# Altium project LM_HTR_001_Rev_C.PrjPcb
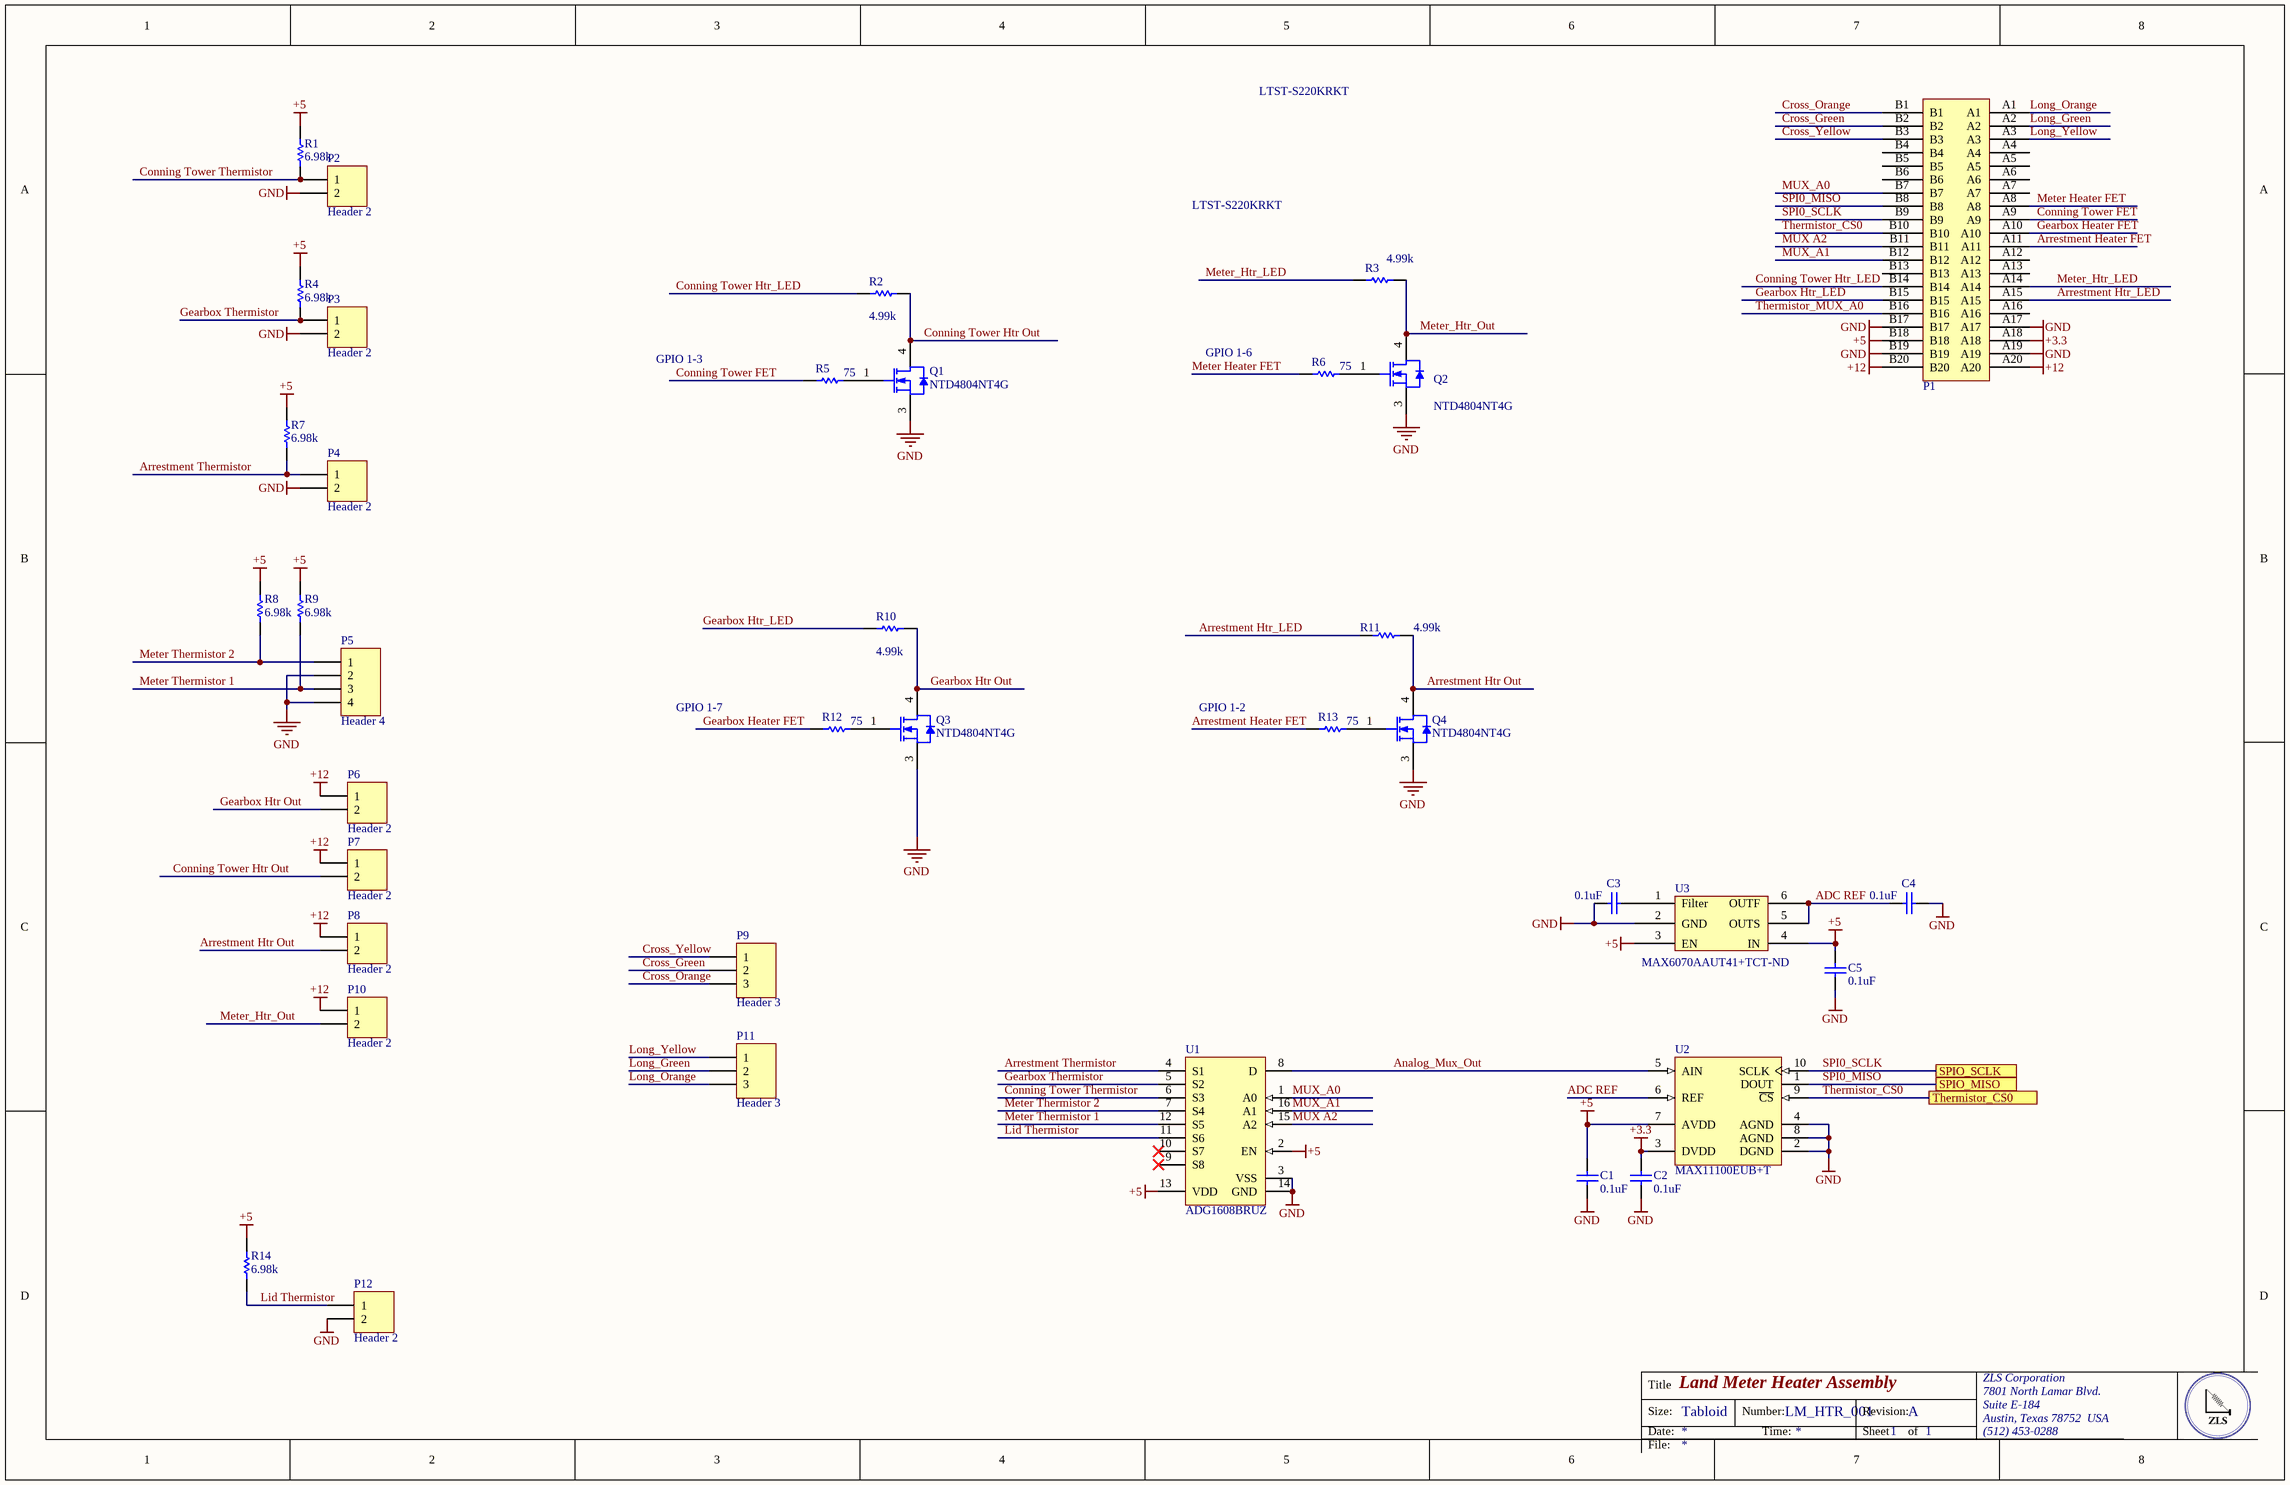
[diagram p0: LM_HTR_001.SchDoc]
2 sheets, 86 parts. Net scope: flat (ports and power ports of the same name join across sheets).
Board file: LM_HTR_001.PcbDoc
Sheets:
  LM_HTR_001.SchDoc
  Signal_Conditioner.SchDoc

## Sheet LM_HTR_001.SchDoc: Land Meter Heater Assembly
size Tabloid; DocumentNumber: LM_HTR_001; Revision: A; SheetNumber: 1; SheetTotal: 1

### Parts
C1  0.1uF  [CAPC0402(1005)60_L]
C2  0.1uF  [CAPC0402(1005)60_L]
C3  0.1uF  [CAPC0402(1005)60_L]
C4  0.1uF  [CAPC0402(1005)60_L]
C5  0.1uF  [CAPC0402(1005)60_L]
P1  MEC6-120-02-PCB_  [MEC6-120-02-PCB]  (value not drawn)
P2  Header 2  [HDR1X2]
P3  Header 2  [HDR1X2]
P4  Header 2  [HDR1X2]
P5  Header 4  [HDR1X4]
P6  Header 2  [HDR1X2]
P7  Header 2  [HDR1X2]
P8  Header 2  [HDR1X2]
P9  Header 3  [HDR1X3]
P10  Header 2  [HDR1X2]
P11  Header 3  [HDR1X3]
P12  Header 2  [HDR1X2]
Q1  NTD4804NT4G  [ONSC-DPAK-3-369AA-01_V]
Q2  NTD4804NT4G  [ONSC-DPAK-3-369AA-01_V]
Q3  NTD4804NT4G  [ONSC-DPAK-3-369AA-01_V]
Q4  NTD4804NT4G  [ONSC-DPAK-3-369AA-01_V]
R1  Resistance (Ohms): 6.98k  [RESC0805(2012)_N]  (hidden comment: 6K98 1% 0805(2012))
R2  Resistance (Ohms): 4.99k  [RESC0805(2012)_L]
R3  Resistance (Ohms): 4.99k  [RESC0805(2012)_L]
R4  Resistance (Ohms): 6.98k  [RESC0805(2012)_N]  (hidden comment: 6K98 1% 0805(2012))
R5  Resistance (Ohms): 75  [RESC0805(2012)_L]
R6  Resistance (Ohms): 75  [RESC0805(2012)_L]
R7  Resistance (Ohms): 6.98k  [RESC0805(2012)_N]  (hidden comment: 6K98 1% 0805(2012))
R8  Resistance (Ohms): 6.98k  [RESC0805(2012)_N]  (hidden comment: 6K98 1% 0805(2012))
R9  Resistance (Ohms): 6.98k  [RESC0805(2012)_N]  (hidden comment: 6K98 1% 0805(2012))
R10  Resistance (Ohms): 4.99k  [RESC0805(2012)_L]
R11  Resistance (Ohms): 4.99k  [RESC0805(2012)_L]
R12  Resistance (Ohms): 75  [RESC0805(2012)_L]
R13  Resistance (Ohms): 75  [RESC0805(2012)_L]
R14  Resistance (Ohms): 6.98k  [RESC0805(2012)_N]  (hidden comment: 6K98 1% 0805(2012))
U1  ADG1608BRUZ  [ADI-RU-16_M]
U2  MAX11100EUB+T  [U10+2_L]
U3  Supplier Part Number 1: MAX6070AAUT41+TCT-ND  [SOT95P280X445-6N]  (hidden comment: MAX6070AAUT41+T)

### Ports
SPIO_MISO, SPIO_SCLK, Thermistor_CS0

### Nets
+3.3: C2.1 P1.A18 U2.3(DVDD)
+5: C1.1 C5.1 P1.B18 R1.2 R4.2 R7.1 R8.1 R9.2 R14.1 U1.2(EN) U1.13(VDD) U2.7(AVDD) U3.3(EN) U3.4(IN)
+12: P1.A20 P1.B20 P6.1 P7.1 P8.1 P10.1
GND: C1.2 C2.2 C3.2 C4.1 C5.2 P1.A17 P1.A19 P1.B17 P1.B19 P2.2 P3.2 P4.2 P5.2 P5.4 P12.2 Q1.3(S) Q2.3(S) Q3.3(S) Q4.3(S) U1.3(VSS) U1.14(GND) U2.2(DGND) U2.4(AGND) U2.8(AGND) U3.2(GND)
ADC REF: C4.2 U2.6(REF) U3.5(OUTS) U3.6(OUTF)
Analog_Mux_Out: U1.8(D) U2.5(AIN)
Arrestment Heater FET: P1.A11 R13.1
Arrestment Htr Out: P8.2 Q4.4(D) R11.2
Arrestment Htr_LED: P1.A15 R11.1
Arrestment Thermistor: P4.1 R7.2 U1.4(S1)
Conning Tower FET: P1.A9 R5.1
Conning Tower Htr Out: P7.2 Q1.4(D) R2.1
Conning Tower Htr_LED: P1.B14 R2.2
Conning Tower Thermistor: P2.1 R1.1 U1.6(S3)
Cross_Green: P1.B2 P9.2
Cross_Orange: P1.B1 P9.3
Cross_Yellow: P1.B3 P9.1
Gearbox Heater FET: P1.A10 R12.1
Gearbox Htr Out: P6.2 Q3.4(D) R10.1
Gearbox Htr_LED: P1.B15 R10.2
Gearbox Thermistor: P3.1 R4.1 U1.5(S2)
Lid Thermistor: P12.1 R14.2 U1.11(S6)
Long_Green: P1.A2 P11.2
Long_Orange: P1.A1 P11.3
Long_Yellow: P1.A3 P11.1
Meter Heater FET: P1.A8 R6.1
Meter Thermistor 1: P5.3 R9.1 U1.12(S5)
Meter Thermistor 2: P5.1 R8.2 U1.7(S4)
Meter_Htr_LED: P1.A14 R3.1
Meter_Htr_Out: P10.2 Q2.4(D) R3.2
MUX A2: P1.B11 U1.15(A2)
MUX_A0: P1.B7 U1.1(A0)
MUX_A1: P1.B12 U1.16(A1)
SPI0_MISO: P1.B8 U2.1(DOUT) ; port SPIO_MISO
SPI0_SCLK: P1.B9 U2.10(SCLK) ; port SPIO_SCLK
Thermistor_CS0: P1.B10 U2.9(~{CS}) ; port Thermistor_CS0
Thermistor_MUX_A0: P1.B16
NetC3_1: C3.1 U3.1(Filter)
NetQ1_1: Q1.1(G) R5.2
NetQ2_1: Q2.1(G) R6.2
NetQ3_1: Q3.1(G) R12.2
NetQ4_1: Q4.1(G) R13.2

Not connected (* = marked no-connect by the designer): P1 A4 A5 A6 A7 A12 A13 A16 B4 B5 B6 B13; U1 9(S8)* 10(S7)*

### Notes on the sheet
- LTST-S220KRKT
- GPIO 1-3
- GPIO 1-6
- GPIO 1-7
- GPIO 1-2
- Title
- Size:
- Date:
- Tabloid
- Number:
- Time:
- Revision:
- Sheet
- of
- ZLS Corporation
- 7801 North Lamar Blvd.
- Suite E-184
- Austin, Texas 78752  USA
- (512) 453-0288
- File:

### Library data of the parts
C1-C5 = CMP-1034-00252-1: CAP CER 0.1UF 10V X7R 0402; Manufacturer: Murata Electronics North America; Manufacturer Part Number: GRM155R71A104KA01D; Tolerance: ±10%; Supplier 1: Digi-Key; Supplier Part Number 1: 490-6321-1-ND; RoHS: RoHS Compliant; Category: Capacitors; Stock 1: 2920395; Pricing 1: 1=0.1, 10=0.014, 100=0.0063, 500=0.00446, 1000=0.00351, 2500=0.00319, 5000=0.00293 (USD); Packaging: Cut Tape (CT); Part Status: Active; Voltage - Rated: 10V; Temperature Coefficient: X7R; Operating Temperature: -55°C ~ 125°C; Features: -; Ratings: -; Applications: General Purpose; Mounting Type: Surface Mount, MLCC; Package / Case: 0402 (1005 Metric); Size / Dimension: 0.039" L x 0.020" W (1.00mm x 0.50mm); Height - Seated (Max): -; Thickness (Max): 0.022" (0.55mm); Lead Spacing: -; ComponentLink1URL: http://www.murata.com/~/media/webrenewal/support/library/catalog/products/capacitor/mlcc/c02e.ashx?la=en-us; ComponentLink1Description: http://www.murata.com/~/media/webrenewal/support/library/catalog/products/capacitor/mlcc/c02e.ashx?la=en-us
P2-P4 P6-P8 P10 P12 = Header 2: Header, 2-Pin; LatestRevisionDate: 17-Jul-2002; LatestRevisionNote: Re-released for DXP Platform.; Publisher: Altium Limited
P5 = Header 4: Header, 4-Pin; LatestRevisionDate: 17-Jul-2002; LatestRevisionNote: Re-released for DXP Platform.; Publisher: Altium Limited
P9 P11 = Header 3: Header, 3-Pin; LatestRevisionDate: 17-Jul-2002; LatestRevisionNote: Re-released for DXP Platform.; Publisher: Altium Limited
Q1-Q4 = CMP-1058-00341-1: Power MOSFET, 30 V, 117 A, Single N-Channel, 3-Pin DPAK, Pb-Free, Tape and Reel; Manufacturer: On Semiconductor; Coss Typ (pF): 952; Qrr Typ (nC): 30; VGS Max (V): 20; ID Max (A): 117; Crss Typ (pF): 556; Channel Polarity: N Channel; Ciss Typ (pF): 4490; VGS(th) Max (V): 2.5; ComponentLink2Description: Datasheet; ComponentLink3Description: Package Specification; Mounting Technology: Surface Mount; PackageDescription: 3-Pin Flange Mount, Body 6.54 x 6.095 mm, Pitch 2.29 mm; PackageVersion: Rev. B, 06/2010; PartNumber: NTD4804NT4G; ComponentLink2URL: http://www.onsemi.cn/pub_link/Collateral/NTD4804N-D.PDF; RoHS: Pb-Free; Configuration: Single; DatasheetVersion: Rev. 8; PackageReference: DPAK-3-369AA-01; ComponentLink3URL: http://www.onsemi.cn/pub_link/Collateral/369AA.PDF; ComponentLink1Description: Manufacturer URL; Packing: Tape and Reel; Package Type: DPAK-3; ComponentLink1URL: http://www.onsemi.com/; V(BR)DSS Min (V): 30; Supplier 1: Digi-Key; Supplier Part Number 1: NTD4804NT4GOSDKR-ND
R1 R4 R7-R9 R14 = CMP-1013-00606-1: 6K98 0.125W 1% 0805 (2012 Metric)  SMD; Manufacturer: Vishay Dale; Manufacturer Part Number: CRCW08056K98FKEA; Power (Watts): 0.125W, 1/8W; Temperature Coefficient: ±100ppm/°C; Supplier 1: Digi-Key; Supplier Part Number 1: 541-6.98KCCT-ND; RoHS: RoHS Compliant; Category: Resistors; Stock 1: 34245; Pricing 1: 1=0.1, 10=0.044, 100=0.0178, 1000=0.00802, 2500=0.00696 (USD); Packaging: Cut Tape (CT); Part Status: Active; Tolerance: ±1%; Composition: Thick Film; Features: Automotive AEC-Q200; Operating Temperature: -55°C ~ 155°C; Package / Case: 0805 (2012 Metric); Supplier Device Package: 0805; Size / Dimension: 0.079" L x 0.049" W (2.00mm x 1.25mm); Height - Seated (Max): 0.020" (0.50mm); Failure Rate: -; ComponentLink1URL: http://www.vishay.com/docs/20035/dcrcwe3.pdf; ComponentLink1Description: http://www.vishay.com/docs/20035/dcrcwe3.pdf
R2 R3 R10 R11 = CMP-1013-00393-1: Manufacturer: Vishay Dale; Manufacturer Part Number: CRCW08054K99FKEA; Tolerance: ±1%; Power (Watts): 0.125W, 1/8W; Temperature Coefficient: ±100ppm/°C; Supplier 1: Digi-Key; Supplier Part Number 1: 541-4.99KCCT-ND; RoHS: RoHS Compliant; Category: Resistors; Stock 1: 93740; Pricing 1: 1=0.1, 10=0.044, 100=0.0178, 1000=0.00802, 2500=0.00696 (USD); Packaging: Cut Tape (CT); Part Status: Active; Composition: Thick Film; Features: Automotive AEC-Q200; Operating Temperature: -55°C ~ 155°C; Package / Case: 0805 (2012 Metric); Supplier Device Package: 0805; Size / Dimension: 0.079" L x 0.049" W (2.00mm x 1.25mm); Height - Seated (Max): 0.020" (0.50mm); Failure Rate: -; ComponentLink1URL: http://www.vishay.com/docs/20035/dcrcwe3.pdf; ComponentLink1Description: http://www.vishay.com/docs/20035/dcrcwe3.pdf
R5 R6 R12 R13 = CMP-1013-00393-1: Manufacturer: Vishay Dale; Manufacturer Part Number: CRCW080575R0FKEA; Tolerance: ±1%; Power (Watts): 0.125W, 1/8W; Temperature Coefficient: ±100ppm/°C; Supplier 1: Digi-Key; Supplier Part Number 1: 541-75.0CCT-ND; RoHS: RoHS Compliant; Category: Resistors; Stock 1: 32546; Pricing 1: 1=0.1, 10=0.044, 100=0.0178, 1000=0.00802, 2500=0.00696 (USD); Packaging: Cut Tape (CT); Part Status: Active; Composition: Thick Film; Features: Automotive AEC-Q200; Operating Temperature: -55°C ~ 155°C; Package / Case: 0805 (2012 Metric); Supplier Device Package: 0805; Size / Dimension: 0.079" L x 0.049" W (2.00mm x 1.25mm); Height - Seated (Max): 0.020" (0.50mm); Failure Rate: -; ComponentLink1URL: http://www.vishay.com/docs/20035/dcrcwe3.pdf; ComponentLink1Description: http://www.vishay.com/docs/20035/dcrcwe3.pdf
U1 = CMP-0793-00136-1: 4.5 Ohm Ron, 8-Channel +/-5 V,+12 V, +5 V and +3.3 V Multiplexer, 16-pin SOP (RU-16), Tube; Manufacturer: Analog Devices; Max Analog Signal Range: 0 to Vdd; Ron (ohms): 4.4; t transition (s): 150n; Bandwidth (Hz): 40M, 40M, 37M, 34M; Code_JEDEC: MO-153AB; PackageReference: RU-16; PackageDescription: 16-Pin Thin Shrink Small Outline Package, Body 5 x 4.4 mm, Pitch 0.65 mm; ComponentLink1Description: Manufacturer URL; ComponentLink2Description: Datasheet; PartNumber: ADG1608BRUZ; Mounting Technology: Surface Mount; PackageVersion: Nov-02; ComponentLink3Description: Package Specification; DatasheetVersion: Rev. 0; Packing: Tube; ComponentLink1URL: http://www.analog.com/en/index.html; ComponentLink3URL: http:/www.analog.com/static/imported-files/packages/36244347913743854010197452789RU16.pdf; ComponentLink2URL: http://www.analog.com/static/imported-files/data_sheets/ADG1608_1609.pdf
U2 = CMP-0249-00017-1: 16-Bit, +5V, 200ksps ADC with 10uA Shutdown, 10-Pin uMAX, -40°C to +85°C, Pb-Free, Tape and Reel; DatasheetVersion: Rev 1, Jan-2012; ComponentLink3URL: http://pdfserv.maxim-ic.com/package_dwgs/21-0061.PDF; PackageReference: U10+2; ComponentLink2URL: http://datasheets.maxim-ic.com/en/ds/MAX11100.pdf; PackageVersion: revL, 2008; ComponentLink1Description: Manufacturer URL; Code_JEDEC: MO-187-BA; ComponentLink1URL: http://www.maxim-ic.com; ComponentLink3Description: Package Specification; PackageDescription: 10-Pin Micro-MAX Thin Shrink Small Outline (uSOP), 3 x 3 x 0.85 mm Body, 0.5 mm Pitch, Pb-Free; ComponentLink2Description: Datasheet
U3 = MAX6070AAUT41+T: IC VREF SERIES 4.096V SOT23; Manufacturer: Maxim Integrated; Output Type: Fixed; Tolerance: ±0.04%; Temperature Coefficient: 6ppm/°C; Noise - 0.1Hz to 10Hz: 9.6µVp-p; Noise - 10Hz to 10kHz: 9µVrms; Voltage - Input: 4.3 V ~ 5.5 V; Current - Supply: 350µA; Supplier 1: Digi-Key; Manufacturer Part Number: MAX6070AAUT41+T; RoHS: RoHS Compliant; Category: Integrated Circuits (ICs); Stock 1: 2623; Pricing 1: 1=3.41, 10=3.213, 25=2.5704, 50=2.4418, 100=2.2491, 250=2.13344, 500=2.05634 (USD); Packaging: Cut Tape (CT); Part Status: Active; Reference Type: Series; Voltage - Output (Min/Fixed): 4.096V; Operating Temperature: -40°C ~ 125°C (TA); Mounting Type: Surface Mount; Package / Case: SOT-23-6; Supplier Device Package: SOT-23-6; ComponentLink1URL: https://datasheets.maximintegrated.com/en/ds/MAX6070-MAX6071.pdf; ComponentLink1Description: https://datasheets.maximintegrated.com/en/ds/MAX6070-MAX6071.pdf

## Sheet Signal_Conditioner.SchDoc: Signal Conditioner
size Tabloid; DocumentNumber: LM-001; Revision: C; SheetNumber: 2; SheetTotal: 2; DocumentName: Signal Conditioner
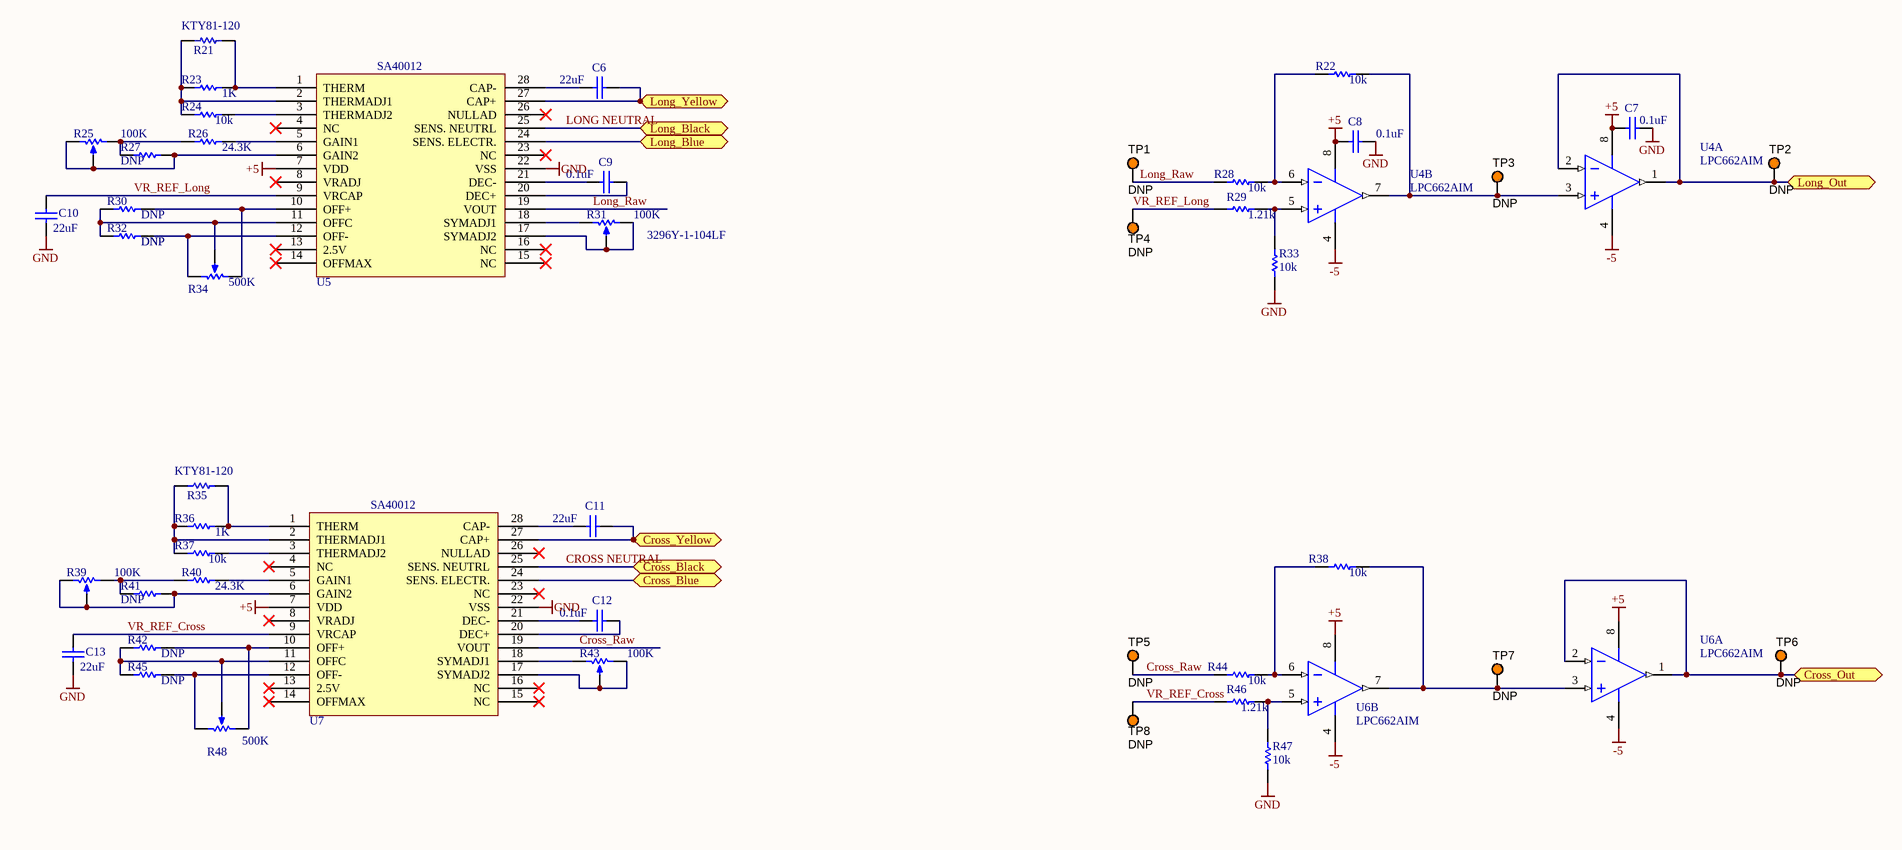
[diagram p1: Signal_Conditioner.SchDoc]

### Parts
C6  22uF  [CAPC0805(2012)145_N]
C7  0.1uF  [CAPC0402(1005)60_L]
C8  0.1uF  [CAPC0402(1005)60_L]
C9  0.1uF  [CAPC0402(1005)60_L]
C10  22uF  [CAPC0805(2012)145_N]
C11  22uF  [CAPC0805(2012)145_N]
C12  0.1uF  [CAPC0402(1005)60_L]
C13  22uF  [CAPC0805(2012)145_N]
R21  KTY81-120  [KTY81-120]
R22  10k  [RESC0805(2012)_L]
R23  1K  [RESC0805(2012)_L]
R24  10k  [RESC0805(2012)_L]
R25  100K  [Trimmer 2.54]
R26  24.3K  [RESC0805(2012)_L]
R27  DNP  [RESC0805(2012)_L]
R28  10k  [RESC0805(2012)_L]
R29  1.21k  [RESC0805(2012)_L]
R30  DNP  [RESC0805(2012)_L]
R31  100K  [Trimmer 2.54]
R32  DNP  [RESC0805(2012)_L]
R33  10k  [RESC0805(2012)_L]
R34  500K  [Trimmer 2.54]
R35  KTY81-120  [KTY81-120]
R36  1K  [RESC0805(2012)_L]
R37  10k  [RESC0805(2012)_L]
R38  10k  [RESC0805(2012)_L]
R39  100K  [Trimmer 2.54]
R40  24.3K  [RESC0805(2012)_L]
R41  DNP  [RESC0805(2012)_L]
R42  DNP  [RESC0805(2012)_L]
R43  100K  [Trimmer 2.54]
R44  10k  [RESC0805(2012)_L]
R45  DNP  [RESC0805(2012)_L]
R46  1.21k  [RESC0805(2012)_L]
R47  10k  [RESC0805(2012)_L]
R48  500K  [Trimmer 2.54]
TP1  DNP  [KSTN-5003]
TP2  DNP  [KSTN-5003]
TP3  DNP  [KSTN-5003]
TP4  DNP  [KSTN-5003]
TP5  DNP  [KSTN-5003]
TP6  DNP  [KSTN-5003]
TP7  DNP  [KSTN-5003]
TP8  DNP  [KSTN-5003]
U4  LPC662AIM  [D0008A_M]  (parts A,B of 2)
U5  SA40012  [SA40012]
U6  LPC662AIM  [D0008A_M]  (parts A,B of 2)
U7  SA40012  [SA40012]

### Ports
Cross_Black, Cross_Blue, Cross_Out, Cross_Yellow, Long_Black, Long_Blue, Long_Out, Long_Yellow

### Nets
+5: C7.1 C8.1 U4.8(V+) U5.7(VDD) U6.8(V+) U7.7(VDD)
-5: U4.4(V-) U6.4(V-)
GND: C7.2 C8.2 C10.2 C13.2 R33.1 R47.1 U5.22(VSS) U7.22(VSS)
CROSS NEUTRAL: U7.25(SENS._NEUTRL) ; port Cross_Black
Cross_Raw: R44.1 TP5.1 U7.19(VOUT)
LONG NEUTRAL: U5.25(SENS._NEUTRL) ; port Long_Black
Long_Raw: R28.1 TP1.1 U5.19(VOUT)
VR_REF_Cross: C13.1 R46.2 TP8.1 U7.9(VRCAP)
VR_REF_Long: C10.1 R29.2 TP4.1 U5.9(VRCAP)
NetC6_1: C6.1 U5.28(CAP-)
NetC6_2: C6.2 U5.27(CAP+) ; port Long_Yellow
NetC9_1: C9.1 U5.20(DEC+)
NetC9_2: C9.2 U5.21(DEC-)
NetC11_1: C11.1 U7.28(CAP-)
NetC11_2: C11.2 U7.27(CAP+) ; port Cross_Yellow
NetC12_1: C12.1 U7.20(DEC+)
NetC12_2: C12.2 U7.21(DEC-)
NetR21_1: R21.1 R23.1 R24.1 U5.2(THERMADJ1)
NetR21_2: R21.2 R23.2 U5.1(THERM)
NetR22_1: R22.1 R28.2 U4.6(INB-)
NetR22_2: R22.2 TP3.1 U4.3(INA+) U4.7(OUTB)
NetR24_2: R24.2 U5.3(THERMADJ2)
NetR25_1: R25.1(a) R25.2(b) R27.2 U5.6(GAIN2)
NetR25_3: R25.3(c) R26.1 R27.1
NetR26_2: R26.2 U5.5(GAIN1)
NetR29_1: R29.1 R33.2 U4.5(INB+)
NetR30_1: R30.1 R32.1 R34.2(b) U5.11(OFFC)
NetR30_2: R30.2 R34.1(a) U5.10(OFF+)
NetR31_1: R31.1(a) U5.18(SYMADJ1)
NetR31_2: R31.2(b) R31.3(c) U5.17(SYMADJ2)
NetR32_2: R32.2 R34.3(c) U5.12(OFF-)
NetR35_1: R35.1 R36.1 R37.1 U7.2(THERMADJ1)
NetR35_2: R35.2 R36.2 U7.1(THERM)
NetR37_2: R37.2 U7.3(THERMADJ2)
NetR38_1: R38.1 R44.2 U6.6(INB-)
NetR38_2: R38.2 TP7.1 U6.3(INA+) U6.7(OUTB)
NetR39_1: R39.1(a) R39.2(b) R41.2 U7.6(GAIN2)
NetR39_3: R39.3(c) R40.1 R41.1
NetR40_2: R40.2 U7.5(GAIN1)
NetR42_1: R42.1 R45.1 R48.2(b) U7.11(OFFC)
NetR42_2: R42.2 R48.1(a) U7.10(OFF+)
NetR43_1: R43.1(a) U7.18(SYMADJ1)
NetR43_2: R43.2(b) R43.3(c) U7.17(SYMADJ2)
NetR45_2: R45.2 R48.3(c) U7.12(OFF-)
NetR46_1: R46.1 R47.2 U6.5(INB+)
NetTP2_1: TP2.1 U4.1(OUTA) U4.2(INA-) ; port Long_Out
NetTP6_1: TP6.1 U6.1(OUTA) U6.2(INA-) ; port Cross_Out
NetU5_24: U5.24(SENS._ELECTR.) ; port Long_Blue
NetU7_24: U7.24(SENS._ELECTR.) ; port Cross_Blue

Not connected (* = marked no-connect by the designer): U5 4(NC)* 8(VRADJ)* 13(2.5V)* 14(OFFMAX)* 15(NC)* 16(NC)* 23(NC)* 26(NULLAD)*; U7 4(NC)* 8(VRADJ)* 13(2.5V)* 14(OFFMAX)* 15(NC)* 16(NC)* 23(NC)* 26(NULLAD)*

### Notes on the sheet
- (near R32) DNP
- (near R31) 3296Y-1-104LF
- Title
- Size:
- Date:
- Tabloid
- Number:
- Time:
- Revision:
- Sheet
- of
- ZLS Corporation
- 7801 North Lamar Blvd.
- Suite E-184
- Austin, Texas 78752  USA
- (512) 453-0288
- File:

### Library data of the parts
C6 C10 C11 C13 = CMP-1036-04795-1: CAP CER 22UF 16V X5R 0805; Manufacturer: Murata Electronics North America; Manufacturer Part Number: GRM219R61C226ME15L; Tolerance: ±20%; Notification: Current market demand for these product types have resulted in fluctuating and extending lead times. Lead times may differ.; Supplier 1: Digi-Key; Supplier Part Number 1: 490-9952-1-ND; RoHS: RoHS Compliant; Category: Capacitors; Stock 1: 200; Pricing 1: 1=0.51, 10=0.359, 100=0.2364, 500=0.1751, 1000=0.14884 (USD); Packaging: Cut Tape (CT); Part Status: Active; Voltage - Rated: 16V; Temperature Coefficient: X5R; Operating Temperature: -55°C ~ 85°C; Features: -; Ratings: -; Applications: General Purpose; Mounting Type: Surface Mount, MLCC; Package / Case: 0805 (2012 Metric); Size / Dimension: 0.079" L x 0.049" W (2.00mm x 1.25mm); Height - Seated (Max): -; Thickness (Max): 0.039" (1.00mm); Lead Spacing: -; Lead Style: -; ComponentLink1URL: http://search.murata.co.jp/Ceramy/image/img/A01X/G101/ENG/GRM219R61C226ME15-01.pdf; ComponentLink1Description: http://search.murata.co.jp/Ceramy/image/img/A01X/G101/ENG/GRM219R61C226ME15-01.pdf
C7 C8 = CMP-1034-00252-1: as C1 on sheet LM_HTR_001; Supplier 1: Digi-Key; Supplier Part Number 1: 490-6321-1-ND; RoHS: RoHS Compliant; Category: Capacitors; Stock 1: 2920395; Pricing 1: 1=0.1, 10=0.014, 100=0.0063, 500=0.00446, 1000=0.00351, 2500=0.00319, 5000=0.00293 (USD); Packaging: Cut Tape (CT); Part Status: Active; Voltage - Rated: 10V; Temperature Coefficient: X7R; Operating Temperature: -55°C ~ 125°C; Features: -; Ratings: -; Applications: General Purpose; Mounting Type: Surface Mount, MLCC; Package / Case: 0402 (1005 Metric); Size / Dimension: 0.039" L x 0.020" W (1.00mm x 0.50mm); Height - Seated (Max): -; Thickness (Max): 0.022" (0.55mm); Lead Spacing: -; ComponentLink1URL: http://www.murata.com/~/media/webrenewal/support/library/catalog/products/capacitor/mlcc/c02e.ashx?la=en-us; ComponentLink1Description: http://www.murata.com/~/media/webrenewal/support/library/catalog/products/capacitor/mlcc/c02e.ashx?la=en-us
C9 C12 = CMP-1034-00252-1: CAP CER 0.1UF 10V X7R 0402
R21 R35 = KTY81-120: THERMISTOR PTC 1K OHM PBCYT2; Manufacturer: NXP USA Inc.; Manufacturer Part Number: KTY81/120,112; Supplier 1: Digi-Key; Supplier Part Number 1: 568-12506-ND; RoHS: RoHS Compliant; Category: Sensors, Transducers; Stock 1: 2002; Pricing 1: 1=1.11, 5=1.068, 10=0.868, 25=0.748, 50=0.648, 100=0.5878, 500=0.49432, 1000=0.44088, 5000=0.4008 (USD); Packaging: Bulk; Part Status: Active; Resistance Tolerance: -; Operating Temperature: -55°C ~ 150°C; Mounting Type: Through Hole; Package / Case: TO-226-2, TO-92-2 (TO-226AC); Supplier Device Package: PBCYT2; ComponentLink1URL: http://www.nxp.com/documents/data_sheet/KTY81_SER.pdf; ComponentLink1Description: http://www.nxp.com/documents/data_sheet/KTY81_SER.pdf
R22 R24 R27 R28 R33 R37 R38 R41 R44 R47 = CMP-1013-00393-1: RES SMD 10K OHM 1% 1/8W 0805; Manufacturer: Vishay Dale; Manufacturer Part Number: CRCW080510K0FKEA; Power (Watts): 0.125W, 1/8W; Temperature Coefficient: ±100ppm/°C; Supplier 1: Digi-Key; Supplier Part Number 1: 541-10.0KCCT-ND; RoHS: RoHS Compliant; Category: Resistors; Stock 1: 1858038; Pricing 1: 1=0.1, 10=0.055, 100=0.0223, 1000=0.01003, 2500=0.0087 (USD); Packaging: Cut Tape (CT); Part Status: Active; Tolerance: ±1%; Composition: Thick Film; Features: Automotive AEC-Q200; Operating Temperature: -55°C ~ 155°C; Package / Case: 0805 (2012 Metric); Supplier Device Package: 0805; Size / Dimension: 0.079" L x 0.049" W (2.00mm x 1.25mm); Height - Seated (Max): 0.020" (0.50mm); Failure Rate: -; ComponentLink1URL: http://www.vishay.com/docs/20035/dcrcwe3.pdf; ComponentLink1Description: http://www.vishay.com/docs/20035/dcrcwe3.pdf
R23 R36 = CMP-1013-00393-1: RES SMD 1K OHM 1% 1/8W 0805; Manufacturer: Vishay Dale; Manufacturer Part Number: CRCW08051K00FKEA; Power (Watts): 0.125W, 1/8W; Temperature Coefficient: ±100ppm/°C; Supplier 1: Digi-Key; Supplier Part Number 1: 541-1.00KCCT-ND; RoHS: RoHS Compliant; Category: Resistors; Stock 1: 157631; Pricing 1: 1=0.1, 10=0.055, 100=0.0223, 1000=0.01003, 2500=0.0087 (USD); Packaging: Cut Tape (CT); Part Status: Active; Tolerance: ±1%; Composition: Thick Film; Features: Automotive AEC-Q200; Operating Temperature: -55°C ~ 155°C; Package / Case: 0805 (2012 Metric); Supplier Device Package: 0805; Size / Dimension: 0.079" L x 0.049" W (2.00mm x 1.25mm); Height - Seated (Max): 0.020" (0.50mm); Failure Rate: -; ComponentLink1URL: http://www.vishay.com/docs/20035/dcrcwe3.pdf; ComponentLink1Description: http://www.vishay.com/docs/20035/dcrcwe3.pdf
R25 R31 R39 R43 = Trimmer: TRIMMER 5K OHM 0.25W PC PIN; Manufacturer: Bourns Inc.; Manufacturer Part Number: 3296Y-1-104LF; Power (Watts): 0.5W, 1/2W; Tolerance: ±10%; Temperature Coefficient: ±100ppm/°C; Adjustment Type: Top Adjustment; Resistive Material: Cermet; Supplier 1: Digi-Key; Supplier Part Number 1: 3296Y-104LF-ND; RoHS: RoHS Compliant; Category: Potentiometers, Variable Resistors; Stock 1: 10872; Pricing 1: 1=2.41, 10=2.117, 25=1.898, 50=1.825, 100=1.752, 250=1.679, 500=1.387, 1000=1.314, 5000=1.095 (USD); Packaging: Tube; Part Status: Active; Mounting Type: Through Hole; Termination Style: PC Pins; Size / Dimension: Rectangular - 0.375" x 0.190" Face x 0.395" H (9.53mm x 4.83mm x 10.03mm); ComponentLink1URL: https://www.bourns.com/docs/Product-Datasheets/3296.pdf; ComponentLink1Description: https://www.bourns.com/docs/Product-Datasheets/3296.pdf
R26 R40 = CMP-1013-00393-1: RES SMD 24.3K OHM 1% 1/8W 0805; Manufacturer: Vishay Dale; Manufacturer Part Number: CRCW080524K3FKEA; Power (Watts): 0.125W, 1/8W; Temperature Coefficient: ±100ppm/°C; Supplier 1: Digi-Key; Supplier Part Number 1: 541-24.3KCCT-ND; RoHS: RoHS Compliant; Category: Resistors; Stock 1: 35; Pricing 1: 1=0.1, 10=0.055, 100=0.0223, 1000=0.01003, 2500=0.0087 (USD); Packaging: Cut Tape (CT); Part Status: Active; Tolerance: ±1%; Composition: Thick Film; Features: Automotive AEC-Q200; Operating Temperature: -55°C ~ 155°C; Package / Case: 0805 (2012 Metric); Supplier Device Package: 0805; Size / Dimension: 0.079" L x 0.049" W (2.00mm x 1.25mm); Height - Seated (Max): 0.020" (0.50mm); Failure Rate: -; ComponentLink1URL: http://www.vishay.com/docs/20035/dcrcwe3.pdf; ComponentLink1Description: http://www.vishay.com/docs/20035/dcrcwe3.pdf
R29 R46 = CMP-1013-00393-1: RES SMD 1.21K OHM 1% 1/8W 0805; Manufacturer: Vishay Dale; Manufacturer Part Number: CRCW08051K21FKEA; Power (Watts): 0.125W, 1/8W; Temperature Coefficient: ±100ppm/°C; Supplier 1: Digi-Key; Supplier Part Number 1: 541-1.21KCCT-ND; RoHS: RoHS Compliant; Category: Resistors; Stock 1: 93438; Pricing 1: 1=0.1, 10=0.055, 100=0.0223, 1000=0.01003, 2500=0.0087 (USD); Packaging: Cut Tape (CT); Part Status: Active; Tolerance: ±1%; Composition: Thick Film; Features: Automotive AEC-Q200; Operating Temperature: -55°C ~ 155°C; Package / Case: 0805 (2012 Metric); Supplier Device Package: 0805; Size / Dimension: 0.079" L x 0.049" W (2.00mm x 1.25mm); Height - Seated (Max): 0.020" (0.50mm); Failure Rate: -; ComponentLink1URL: http://www.vishay.com/docs/20035/dcrcwe3.pdf; ComponentLink1Description: http://www.vishay.com/docs/20035/dcrcwe3.pdf
R30 R32 R42 R45 = CMP-1013-00393-1: RES SMD 249K OHM 1% 1/8W 0805; Manufacturer: Vishay Dale; Manufacturer Part Number: CRCW0805249KFKECC; Power (Watts): 0.125W, 1/8W; Temperature Coefficient: ±100ppm/°C; Supplier 1: Digi-Key; Supplier Part Number 1: 541-4128-1-ND; RoHS: RoHS Compliant; Category: Resistors; Stock 1: 19464; Pricing 1: 1=0.1, 10=0.06, 100=0.0244, 1000=0.01094, 2500=0.0095, 5000=0.00785 (USD); Packaging: Cut Tape (CT); Part Status: Active; Tolerance: ±1%; Composition: Thick Film; Features: -; Operating Temperature: -55°C ~ 155°C; Package / Case: 0805 (2012 Metric); Supplier Device Package: 0805; Size / Dimension: 0.079" L x 0.049" W (2.00mm x 1.25mm); Height - Seated (Max): 0.024" (0.60mm); Failure Rate: -; ComponentLink1URL: http://www.vishay.com/docs/28773/crcwce3.pdf; ComponentLink1Description: http://www.vishay.com/docs/28773/crcwce3.pdf
R34 R48 = Trimmer: TRIMMER 500K OHM 0.5W PC PIN TOP; Manufacturer: Bourns Inc.; Manufacturer Part Number: 3296Y-1-504LF; Power (Watts): 0.5W, 1/2W; Tolerance: ±10%; Temperature Coefficient: ±100ppm/°C; Adjustment Type: Top Adjustment; Resistive Material: Cermet; Supplier 1: Digi-Key; Supplier Part Number 1: 3296Y-504LF-ND; RoHS: RoHS Compliant; Category: Potentiometers, Variable Resistors; Stock 1: 2109; Pricing 1: 1=2.41, 10=2.117, 25=1.898, 50=1.825, 100=1.752, 300=1.679, 500=1.387, 1000=1.314, 5000=1.095 (USD); Packaging: Tube; Part Status: Active; Mounting Type: Through Hole; Termination Style: PC Pins; Size / Dimension: Rectangular - 0.375" x 0.190" Face x 0.395" H (9.53mm x 4.83mm x 10.03mm); ComponentLink1URL: https://www.bourns.com/docs/Product-Datasheets/3296.pdf; ComponentLink1Description: https://www.bourns.com/docs/Product-Datasheets/3296.pdf
TP1-TP8 = CMP-1672-00009-1: Test Point, Orange, 1-Pin THD, RoHS; Manufacturer: Keystone Electronics; Manufacturer Part Number: 5003; Peak Reverse Current: 600 uA; Forward Current: 3 A; Max Surge Current: 80 A; Forward Voltage: 1.08 V; Description: KEYSTONE         5003             TEST POINT, PCB, THROUGH HOLE; Plating: Silver; Body Material: PBT; Outside Diameter: 2.54mm; Inside Diameter: 1.27mm; Max Operating Temperature: 150 degC; PackageReference: 5003; Pins: 2; ComponentLink2URL: http://keyelco.com/userAssets/file/M65p56.pdf; PackageDescription: 1-Pin Through Hole Device, Dia 2.54 mm; Weight: 0.01 lb; Diameter: 5.3 mm; Mount: Through Hole; Package Quantity: 500; Packaging: Bulk; Min Operating Temperature: -65 degC; ComponentLink1Description: Manufacturer URL; Height: 0.25 inch; ComponentLink1URL: http://www.keyelco.com/; ComponentLink2Description: Datasheet; Width: 0.25 inch; REACH SVHC: No SVHC; RoHSCompliant: true; Radiation Hardening: No; Length: 9.5 mm; DatasheetVersion: Jun-15; Supplier 1: Future Electronics; Supplier Part Number 1: 1432640; Stock 1: 5752; Pricing 1: 100=0.176, 500=0.148, 1000=0.146, 2000=0.143, 4000=0.141 (USD); Number of Pins: 1; Colour: Orange,White; Contact Material: Bronze; Contact Plating: Silver,Tin; Material: Bronze,Nylon,Silver; Termination: Through Hole; Lead Free: Lead Free; Flammability Rating: UL94 V-0
U4 U6 = CMP-0055-00867-3: Low Power CMOS Dual Operational Amplifier, 8-pin Narrow SOIC; Manufacturer: Texas Instruments; PowerWise: N; CompType: Amplifiers; PackageTopMarking: NSZXTT*LPC66*2AIM; PinCount: 8; Code_JEDEC: MS-012-AA; ComponentLink1URL: http://www.ti.com/general/docs/lit/getliterature.tsp?genericPartNumber=LPC662&fileType=pdf; Code_IPC: SOIC127P600-8; Package Reference: D0008A; PackageDescription: SOIC Narrow, 4.9 x 3.9 x 1.45mm, 8 Lead, 1.27mm Pitch; RoHS: N; ComponentLink1Description: Datasheet URL; PartId: 1
U5 U7 = SA40012: Single Axix CMOS Signal Conditioning Module; Manufacturer: Spectron; Manufacturer Part Number: A40012

## Nets that join several sheets
+5: LM_HTR_001 (14 pins), Signal_Conditioner (6 pins)
GND: LM_HTR_001 (25 pins), Signal_Conditioner (8 pins)